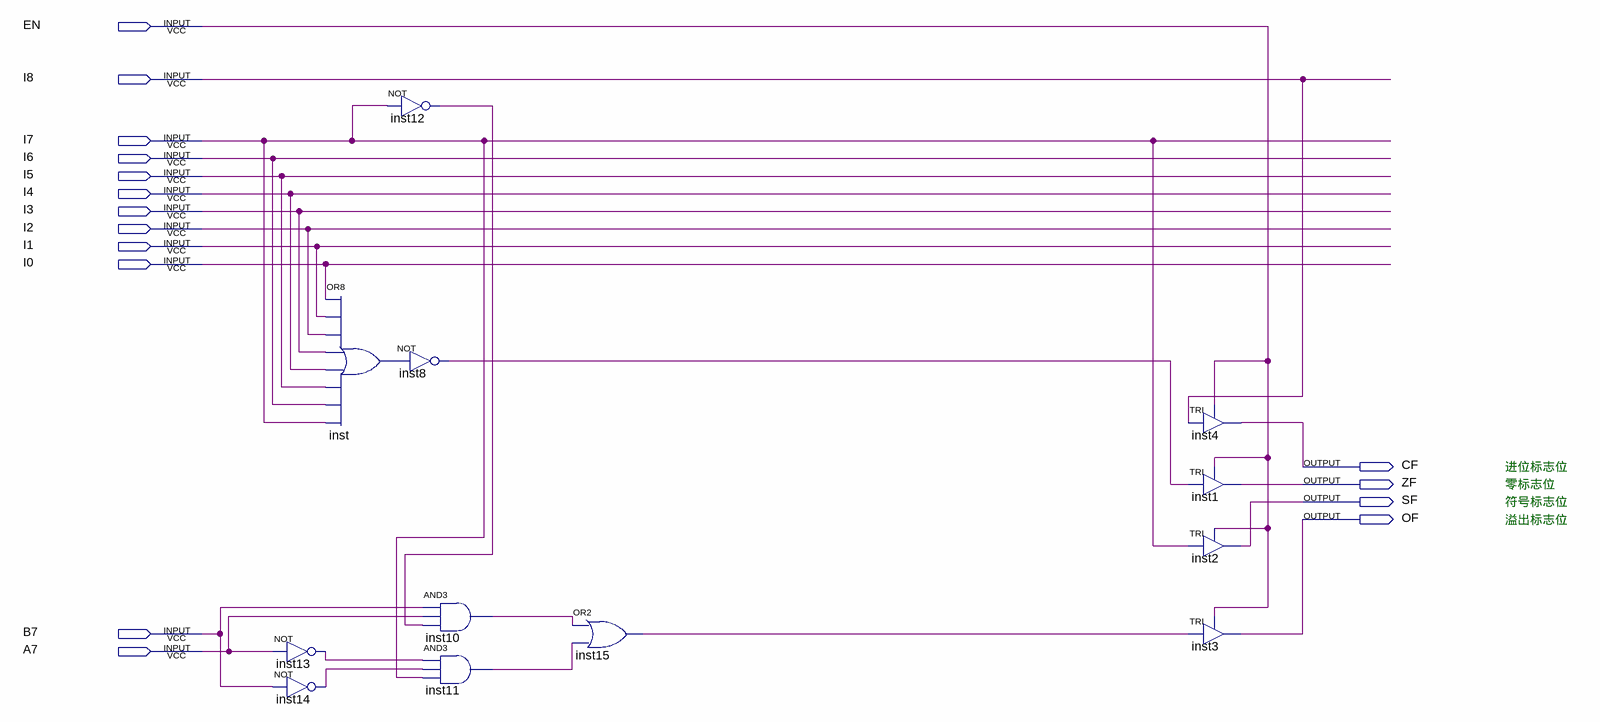
[diagram p0: schematic sheet]
// Quartus schematic condition_getter.bdf as structural Verilog: 12 symbols, 16 pins
module condition_getter (
  input  EN,
  input  I8,
  input  I7,
  input  I6,
  input  I5,
  input  I4,
  input  I3,
  input  I2,
  input  I1,
  input  I0,
  input  B7,
  input  A7,
  output CF,
  output ZF,
  output SF,
  output OF
);

  wire inst8_out, inst10_out, inst11_out, inst12_out, inst13_out, inst14_out, inst15_out, inst_out;

  not inst13 (inst13_out, A7);
  not inst14 (inst14_out, B7);
  or inst (inst_out, I0, I1, I2, I3, I4, I5, I6, I7);
  not inst12 (inst12_out, I7);
  not inst8 (inst8_out, inst_out);
  and inst10 (inst10_out, B7, A7, inst12_out);
  and inst11 (inst11_out, inst13_out, inst14_out, I7);
  or inst15 (inst15_out, inst10_out, inst11_out);
  TRI inst4 (.IN(I8), .OE(EN), .OUT(CF));
  TRI inst1 (.IN(inst8_out), .OE(EN), .OUT(ZF));
  TRI inst2 (.IN(I7), .OE(EN), .OUT(SF));
  TRI inst3 (.IN(inst15_out), .OE(EN), .OUT(OF));

  // Notes on the sheet:
  //   进位标志位
  //   零标志位
  //   符号标志位
  //   溢出标志位
endmodule
